# Altium schematic sheet VHDCI1_connector.SchDoc: VHDCI 1
size 420 x 297 mm; Author: G.K.; CompanyName: WUT; DrawnBy: G.K.; Organization: CERN; Address1: Warsaw Univeristy of Technology; Address2: Nowowiejska 15/19; DocumentNumber: 5; Revision: -; SheetNumber: 5; SheetTotal: 10; EDA_Number: ARTIQ; Projet: Banker; ModifiedBy: -; CreateDate: XX/XX/XXXX; CheckedDate: -; Title2: Connector & driver; DivGrp: ISE; Designer: G.K.; ModifiedDate: -; ProjectName: ADC/DAC MEZZANINE
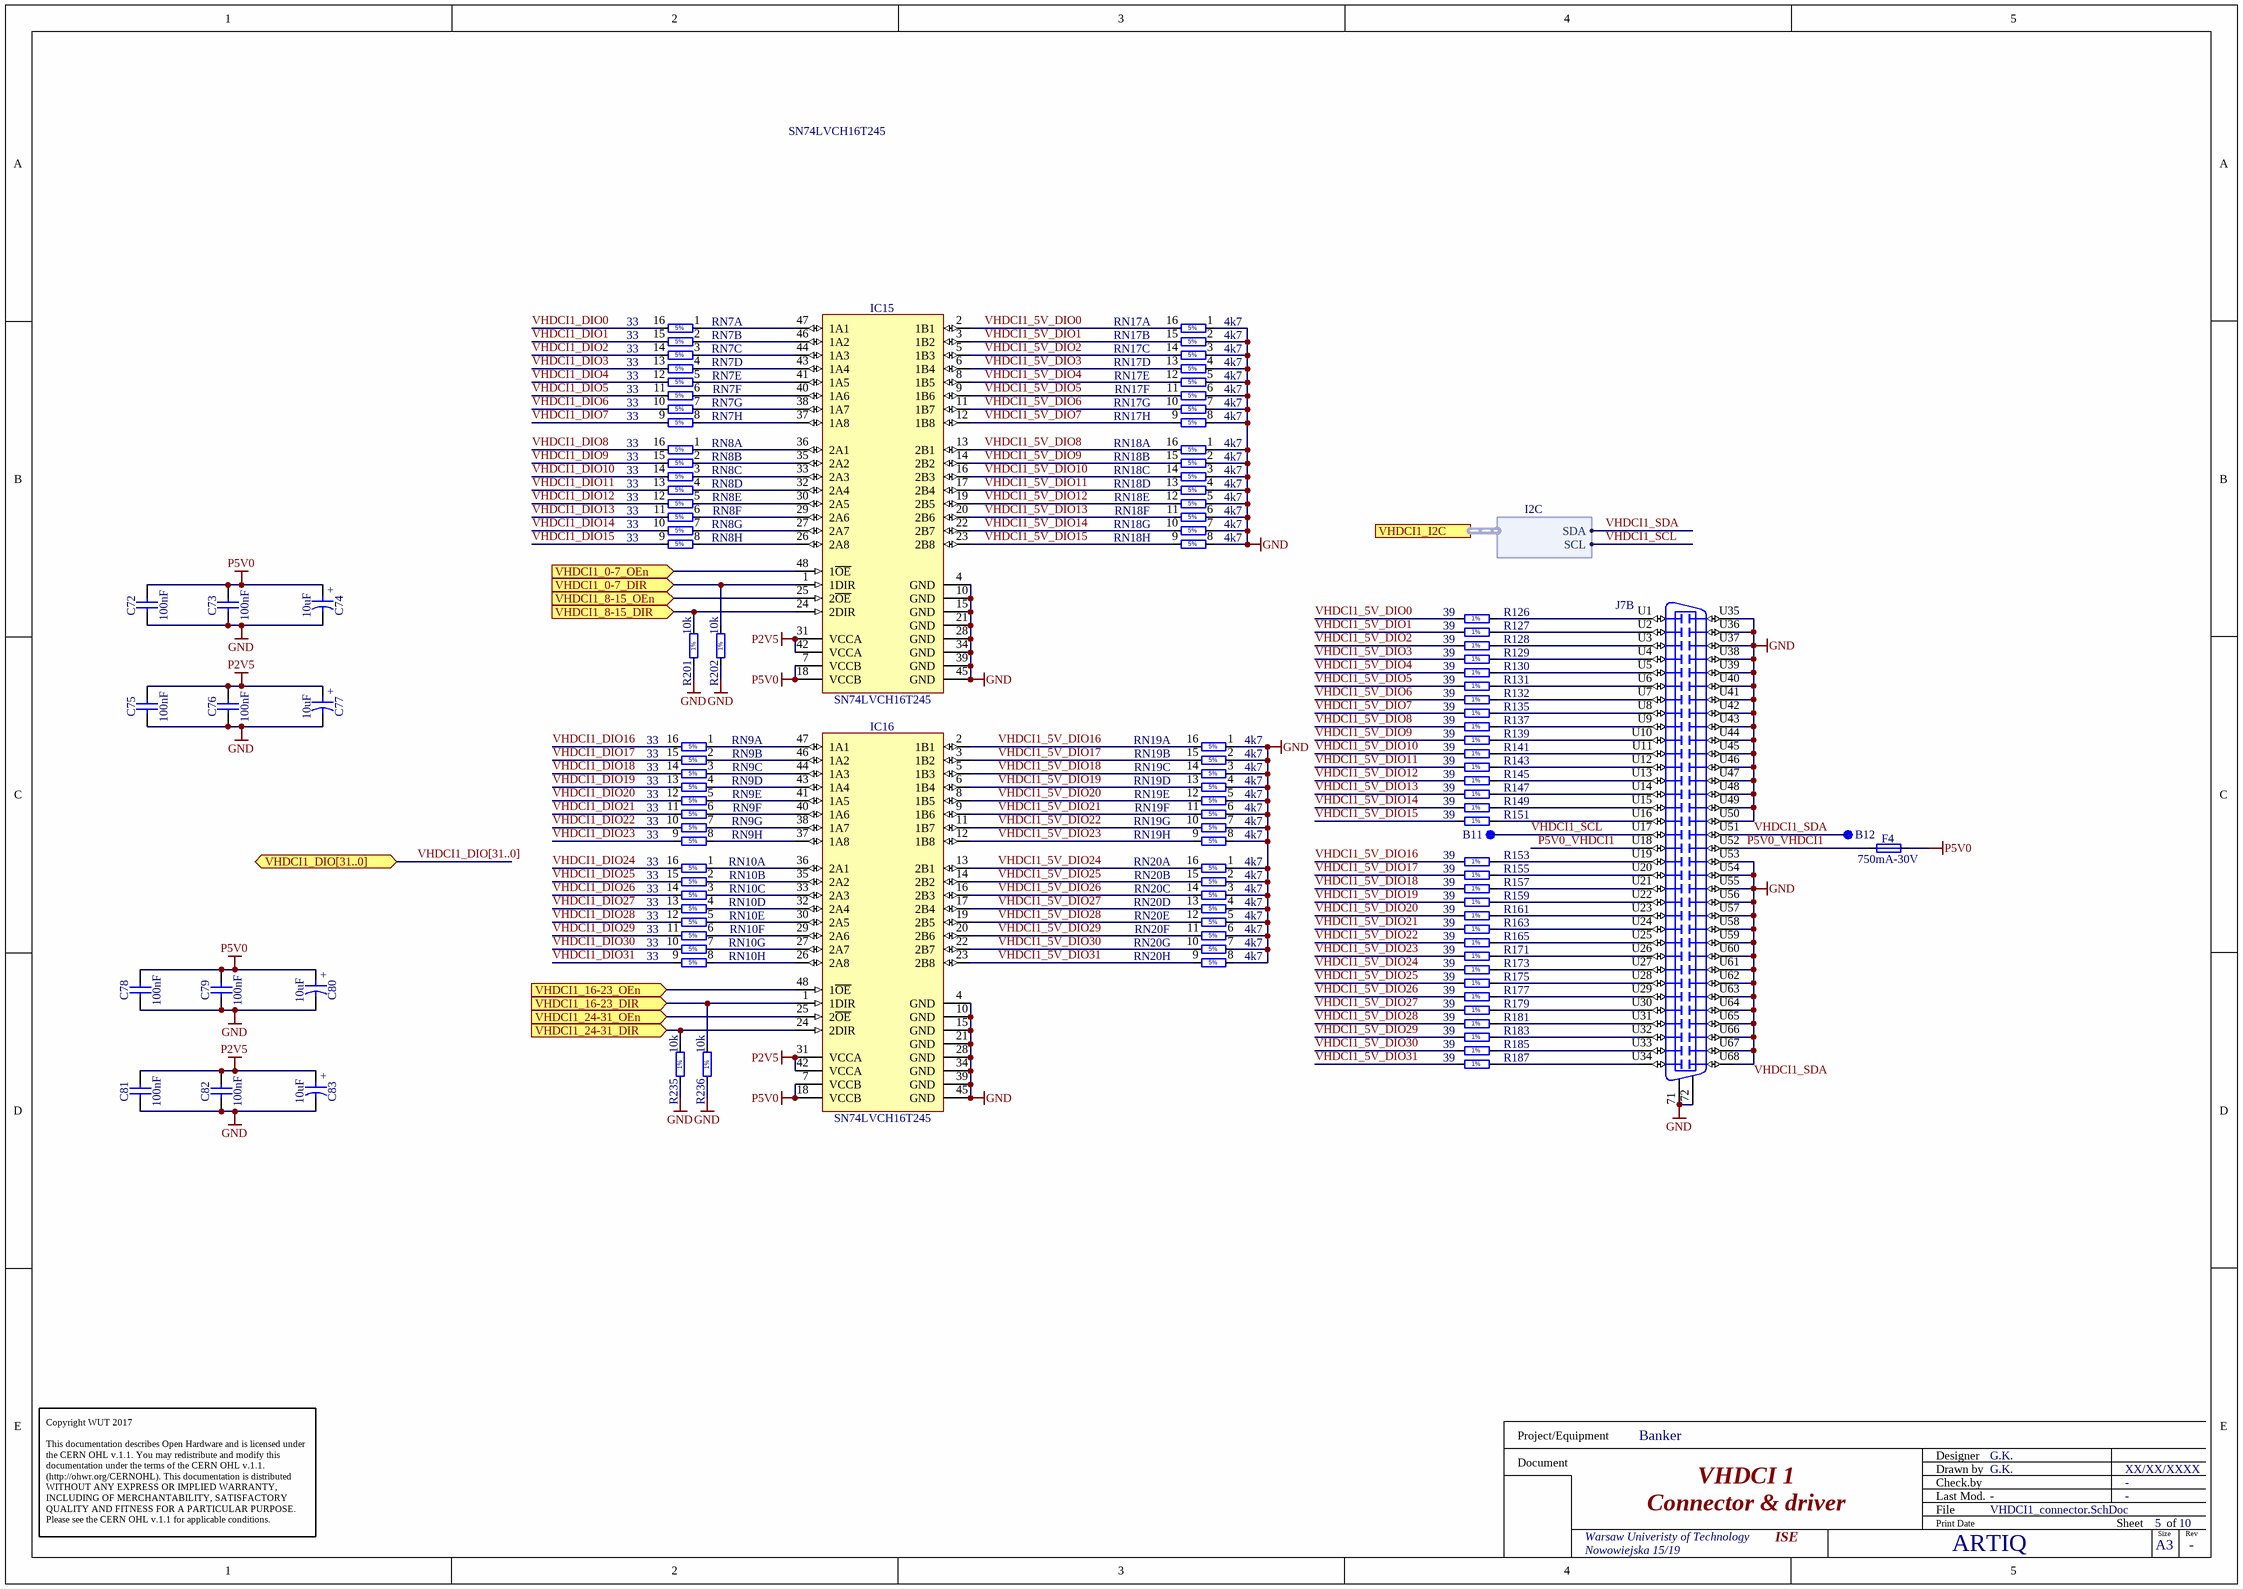
[diagram p0: VHDCI1_connector.SchDoc]

## Parts
B11  SMD Pad  [C100]  (value not drawn)
B12  SMD Pad  [C100]  (value not drawn)
C72  100nF  [CAPC1005X55N]
C73  100nF  [CAPC1005X55N]
C74  10uF  [CAPAE430X540N]
C75  100nF  [CAPC1005X55N]
C76  100nF  [CAPC1005X55N]
C77  10uF  [CAPAE430X540N]
C78  100nF  [CAPC1005X55N]
C79  100nF  [CAPC1005X55N]
C80  10uF  [CAPAE430X540N]
C81  100nF  [CAPC1005X55N]
C82  100nF  [CAPC1005X55N]
C83  10uF  [CAPAE430X540N]
F4  750mA-30V  [FUSR_BOURNS_MF-SM075]
IC15  SN74LVCH16T245  [SOP50P810X120-48N]
IC16  SN74LVCH16T245  [SOP50P810X120-48N]
J7  VHDCI  [MOLEX_74337-0015]  (value not drawn)  (part B of 2)
R126  39  [RESC2012X60N]
R127  39  [RESC2012X60N]
R128  39  [RESC2012X60N]
R129  39  [RESC2012X60N]
R130  39  [RESC2012X60N]
R131  39  [RESC2012X60N]
R132  39  [RESC2012X60N]
R135  39  [RESC2012X60N]
R137  39  [RESC2012X60N]
R139  39  [RESC2012X60N]
R141  39  [RESC2012X60N]
R143  39  [RESC2012X60N]
R145  39  [RESC2012X60N]
R147  39  [RESC2012X60N]
R149  39  [RESC2012X60N]
R151  39  [RESC2012X60N]
R153  39  [RESC2012X60N]
R155  39  [RESC2012X60N]
R157  39  [RESC2012X60N]
R159  39  [RESC2012X60N]
R161  39  [RESC2012X60N]
R163  39  [RESC2012X60N]
R165  39  [RESC2012X60N]
R171  39  [RESC2012X60N]
R173  39  [RESC2012X60N]
R175  39  [RESC2012X60N]
R177  39  [RESC2012X60N]
R179  39  [RESC2012X60N]
R181  39  [RESC2012X60N]
R183  39  [RESC2012X60N]
R185  39  [RESC2012X60N]
R187  39  [RESC2012X60N]
R201  10k  [RESC1005X40N]
R202  10k  [RESC1005X40N]
R235  10k  [RESC1005X40N]
R236  10k  [RESC1005X40N]
RN7  33  [RN_YAGEO_YC248]  (parts A,B,C,D,E,F,G,H of 8)
RN8  33  [RN_YAGEO_YC248]  (parts A,B,C,D,E,F,G,H of 8)
RN9  33  [RN_YAGEO_YC248]  (parts A,B,C,D,E,F,G,H of 8)
RN10  33  [RN_YAGEO_YC248]  (parts A,B,C,D,E,F,G,H of 8)
RN17  4k7  [RN_YAGEO_YC248]  (parts A,B,C,D,E,F,G,H of 8)
RN18  4k7  [RN_YAGEO_YC248]  (parts A,B,C,D,E,F,G,H of 8)
RN19  4k7  [RN_YAGEO_YC248]  (parts A,B,C,D,E,F,G,H of 8)
RN20  4k7  [RN_YAGEO_YC248]  (parts A,B,C,D,E,F,G,H of 8)

## Ports
VHDCI1_0-7_DIR (in), VHDCI1_0-7_OEn (in), VHDCI1_8-15_DIR (in), VHDCI1_8-15_OEn (in), VHDCI1_16-23_DIR (in), VHDCI1_16-23_OEn (in), VHDCI1_24-31_DIR (in), VHDCI1_24-31_OEn (in), VHDCI1_DIO[31..0] (bidir), VHDCI1_I2C (harness I2C)

## Harnesses
I2C: SDA, SCL

## Nets
GND: C72.1 C73.1 C74.2 C75.1 C76.1 C77.2 C78.1 C79.1 C80.2 C81.1 C82.1 C83.2 IC15.4(GND) IC15.10(GND) IC15.15(GND) IC15.21(GND) IC15.28(GND) IC15.34(GND) IC15.39(GND) IC15.45(GND) IC16.4(GND) IC16.10(GND) IC16.15(GND) IC16.21(GND) IC16.28(GND) IC16.34(GND) IC16.39(GND) IC16.45(GND) J7.71 J7.72 J7.U35 J7.U36 J7.U37 J7.U38 J7.U39 J7.U40 J7.U41 J7.U42 J7.U43 J7.U44 J7.U45 J7.U46 J7.U47 J7.U48 J7.U49 J7.U50 J7.U53 J7.U54 J7.U55 J7.U56 J7.U57 J7.U58 J7.U59 J7.U60 J7.U61 J7.U62 J7.U63 J7.U64 J7.U65 J7.U66 J7.U67 J7.U68 R201.1 R202.1 R235.1 R236.1 RN17.1 RN17.2 RN17.3 RN17.4 RN17.5 RN17.6 RN17.7 RN17.8 RN18.1 RN18.2 RN18.3 RN18.4 RN18.5 RN18.6 RN18.7 RN18.8 RN19.1 RN19.2 RN19.3 RN19.4 RN19.5 RN19.6 RN19.7 RN19.8 RN20.1 RN20.2 RN20.3 RN20.4 RN20.5 RN20.6 RN20.7 RN20.8
P2V5: C75.2 C76.2 C77.1 C81.2 C82.2 C83.1 IC15.31(VCCA) IC15.42(VCCA) IC16.31(VCCA) IC16.42(VCCA)
P5V0: C72.2 C73.2 C74.1 C78.2 C79.2 C80.1 F4.2 IC15.7(VCCB) IC15.18(VCCB) IC16.7(VCCB) IC16.18(VCCB)
P5V0_VHDCI1: F4.1 J7.U18 J7.U52
VHDCI1_0-7_DIR: IC15.1(1DIR) R202.2 ; port VHDCI1_0-7_DIR
VHDCI1_0-7_OEn: IC15.48(1~{OE}) ; port VHDCI1_0-7_OEn
VHDCI1_5V_DIO0: IC15.2(1B1) R126.1 RN17.16
VHDCI1_5V_DIO1: IC15.3(1B2) R127.1 RN17.15
VHDCI1_5V_DIO2: IC15.5(1B3) R128.1 RN17.14
VHDCI1_5V_DIO3: IC15.6(1B4) R129.1 RN17.13
VHDCI1_5V_DIO4: IC15.8(1B5) R130.1 RN17.12
VHDCI1_5V_DIO5: IC15.9(1B6) R131.1 RN17.11
VHDCI1_5V_DIO6: IC15.11(1B7) R132.1 RN17.10
VHDCI1_5V_DIO7: IC15.12(1B8) R135.1 RN17.9
VHDCI1_5V_DIO8: IC15.13(2B1) R137.1 RN18.16
VHDCI1_5V_DIO9: IC15.14(2B2) R139.1 RN18.15
VHDCI1_5V_DIO10: IC15.16(2B3) R141.1 RN18.14
VHDCI1_5V_DIO11: IC15.17(2B4) R143.1 RN18.13
VHDCI1_5V_DIO12: IC15.19(2B5) R145.1 RN18.12
VHDCI1_5V_DIO13: IC15.20(2B6) R147.1 RN18.11
VHDCI1_5V_DIO14: IC15.22(2B7) R149.1 RN18.10
VHDCI1_5V_DIO15: IC15.23(2B8) R151.1 RN18.9
VHDCI1_5V_DIO16: IC16.2(1B1) R153.1 RN19.16
VHDCI1_5V_DIO17: IC16.3(1B2) R155.1 RN19.15
VHDCI1_5V_DIO18: IC16.5(1B3) R157.1 RN19.14
VHDCI1_5V_DIO19: IC16.6(1B4) R159.1 RN19.13
VHDCI1_5V_DIO20: IC16.8(1B5) R161.1 RN19.12
VHDCI1_5V_DIO21: IC16.9(1B6) R163.1 RN19.11
VHDCI1_5V_DIO22: IC16.11(1B7) R165.1 RN19.10
VHDCI1_5V_DIO23: IC16.12(1B8) R171.1 RN19.9
VHDCI1_5V_DIO24: IC16.13(2B1) R173.1 RN20.16
VHDCI1_5V_DIO25: IC16.14(2B2) R175.1 RN20.15
VHDCI1_5V_DIO26: IC16.16(2B3) R177.1 RN20.14
VHDCI1_5V_DIO27: IC16.17(2B4) R179.1 RN20.13
VHDCI1_5V_DIO28: IC16.19(2B5) R181.1 RN20.12
VHDCI1_5V_DIO29: IC16.20(2B6) R183.1 RN20.11
VHDCI1_5V_DIO30: IC16.22(2B7) R185.1 RN20.10
VHDCI1_5V_DIO31: IC16.23(2B8) R187.1 RN20.9
VHDCI1_8-15_DIR: IC15.24(2DIR) R201.2 ; port VHDCI1_8-15_DIR
VHDCI1_8-15_OEn: IC15.25(2~{OE}) ; port VHDCI1_8-15_OEn
VHDCI1_16-23_DIR: IC16.1(1DIR) R236.2 ; port VHDCI1_16-23_DIR
VHDCI1_16-23_OEn: IC16.48(1~{OE}) ; port VHDCI1_16-23_OEn
VHDCI1_24-31_DIR: IC16.24(2DIR) R235.2 ; port VHDCI1_24-31_DIR
VHDCI1_24-31_OEn: IC16.25(2~{OE}) ; port VHDCI1_24-31_OEn
VHDCI1_DIO0: RN7.16
VHDCI1_DIO1: RN7.15
VHDCI1_DIO2: RN7.14
VHDCI1_DIO3: RN7.13
VHDCI1_DIO4: RN7.12
VHDCI1_DIO5: RN7.11
VHDCI1_DIO6: RN7.10
VHDCI1_DIO7: RN7.9
VHDCI1_DIO8: RN8.16
VHDCI1_DIO9: RN8.15
VHDCI1_DIO10: RN8.14
VHDCI1_DIO11: RN8.13
VHDCI1_DIO12: RN8.12
VHDCI1_DIO13: RN8.11
VHDCI1_DIO14: RN8.10
VHDCI1_DIO15: RN8.9
VHDCI1_DIO16: RN9.16
VHDCI1_DIO17: RN9.15
VHDCI1_DIO18: RN9.14
VHDCI1_DIO19: RN9.13
VHDCI1_DIO20: RN9.12
VHDCI1_DIO21: RN9.11
VHDCI1_DIO22: RN9.10
VHDCI1_DIO23: RN9.9
VHDCI1_DIO24: RN10.16
VHDCI1_DIO25: RN10.15
VHDCI1_DIO26: RN10.14
VHDCI1_DIO27: RN10.13
VHDCI1_DIO28: RN10.12
VHDCI1_DIO29: RN10.11
VHDCI1_DIO30: RN10.10
VHDCI1_DIO31: RN10.9
VHDCI1_SCL: B11.1 J7.U17 ; port VHDCI1_I2C.SCL
VHDCI1_SDA: B12.1 J7.U51 ; port VHDCI1_I2C.SDA
NetIC15_26: IC15.26(2A8) RN8.8
NetIC15_27: IC15.27(2A7) RN8.7
NetIC15_29: IC15.29(2A6) RN8.6
NetIC15_30: IC15.30(2A5) RN8.5
NetIC15_32: IC15.32(2A4) RN8.4
NetIC15_33: IC15.33(2A3) RN8.3
NetIC15_35: IC15.35(2A2) RN8.2
NetIC15_36: IC15.36(2A1) RN8.1
NetIC15_37: IC15.37(1A8) RN7.8
NetIC15_38: IC15.38(1A7) RN7.7
NetIC15_40: IC15.40(1A6) RN7.6
NetIC15_41: IC15.41(1A5) RN7.5
NetIC15_43: IC15.43(1A4) RN7.4
NetIC15_44: IC15.44(1A3) RN7.3
NetIC15_46: IC15.46(1A2) RN7.2
NetIC15_47: IC15.47(1A1) RN7.1
NetIC16_26: IC16.26(2A8) RN10.8
NetIC16_27: IC16.27(2A7) RN10.7
NetIC16_29: IC16.29(2A6) RN10.6
NetIC16_30: IC16.30(2A5) RN10.5
NetIC16_32: IC16.32(2A4) RN10.4
NetIC16_33: IC16.33(2A3) RN10.3
NetIC16_35: IC16.35(2A2) RN10.2
NetIC16_36: IC16.36(2A1) RN10.1
NetIC16_37: IC16.37(1A8) RN9.8
NetIC16_38: IC16.38(1A7) RN9.7
NetIC16_40: IC16.40(1A6) RN9.6
NetIC16_41: IC16.41(1A5) RN9.5
NetIC16_43: IC16.43(1A4) RN9.4
NetIC16_44: IC16.44(1A3) RN9.3
NetIC16_46: IC16.46(1A2) RN9.2
NetIC16_47: IC16.47(1A1) RN9.1
NetJ7_U1: J7.U1 R126.2
NetJ7_U2: J7.U2 R127.2
NetJ7_U3: J7.U3 R128.2
NetJ7_U4: J7.U4 R129.2
NetJ7_U5: J7.U5 R130.2
NetJ7_U6: J7.U6 R131.2
NetJ7_U7: J7.U7 R132.2
NetJ7_U8: J7.U8 R135.2
NetJ7_U9: J7.U9 R137.2
NetJ7_U10: J7.U10 R139.2
NetJ7_U11: J7.U11 R141.2
NetJ7_U12: J7.U12 R143.2
NetJ7_U13: J7.U13 R145.2
NetJ7_U14: J7.U14 R147.2
NetJ7_U15: J7.U15 R149.2
NetJ7_U16: J7.U16 R151.2
NetJ7_U19: J7.U19 R153.2
NetJ7_U20: J7.U20 R155.2
NetJ7_U21: J7.U21 R157.2
NetJ7_U22: J7.U22 R159.2
NetJ7_U23: J7.U23 R161.2
NetJ7_U24: J7.U24 R163.2
NetJ7_U25: J7.U25 R165.2
NetJ7_U26: J7.U26 R171.2
NetJ7_U27: J7.U27 R173.2
NetJ7_U28: J7.U28 R175.2
NetJ7_U29: J7.U29 R177.2
NetJ7_U30: J7.U30 R179.2
NetJ7_U31: J7.U31 R181.2
NetJ7_U32: J7.U32 R183.2
NetJ7_U33: J7.U33 R185.2
NetJ7_U34: J7.U34 R187.2

## Buses and harness runs
bus VHDCI1_DIO[31..0] = port VHDCI1_DIO[31..0]

## Notes on the sheet
- SN74LVCH16T245
- Copyright WUT 2017
  This documentation describes Open Hardware and is licensed under the CERN OHL v.1.1. You may redistribute and modify this documentation under the terms of the CERN OHL v.1.1. (http://ohwr.org/CERNOHL). This documentation is distributed WITHOUT ANY EXPRESS OR IMPLIED WARRANTY, INCLUDING OF MERCHANTABILITY, SATISFACTORY QUALITY AND FITNESS FOR A PARTICULAR PURPOSE. Please see the CERN OHL v.1.1 for applicable conditions.
- Labels drawn without touching a wire or pin: VHDCI1_SDA
- Project/Equipment
- Document
- Designer
- Drawn by
- Check.by
- File
- Last Mod.
- Print Date
- Sheet
- Size
- A3
- of
- Rev
- (in symbol CAE430-540_10UF_16V_20%) +
- (in symbol R0402_10K_1%_0.0625W_100PPM) 1%
- (in symbol R0805_39R_1%_0.125W_100PPM) 1%
- (in symbol RES_RN_4K7_YAGEO_YC248-JR-074K7L, part A) 5%
- (in symbol RES_RN_4K7_YAGEO_YC248-JR-074K7L, part B) 5%
- (in symbol RES_RN_4K7_YAGEO_YC248-JR-074K7L, part C) 5%
- (in symbol RES_RN_4K7_YAGEO_YC248-JR-074K7L, part D) 5%
- (in symbol RES_RN_4K7_YAGEO_YC248-JR-074K7L, part E) 5%
- (in symbol RES_RN_4K7_YAGEO_YC248-JR-074K7L, part F) 5%
- (in symbol RES_RN_4K7_YAGEO_YC248-JR-074K7L, part G) 5%
- (in symbol RES_RN_4K7_YAGEO_YC248-JR-074K7L, part H) 5%
- (in symbol RN_33R_YAGEO_YC248-JR-0733RL, part A) 5%
- (in symbol RN_33R_YAGEO_YC248-JR-0733RL, part B) 5%
- (in symbol RN_33R_YAGEO_YC248-JR-0733RL, part C) 5%
- (in symbol RN_33R_YAGEO_YC248-JR-0733RL, part D) 5%
- (in symbol RN_33R_YAGEO_YC248-JR-0733RL, part E) 5%
- (in symbol RN_33R_YAGEO_YC248-JR-0733RL, part F) 5%
- (in symbol RN_33R_YAGEO_YC248-JR-0733RL, part G) 5%
- (in symbol RN_33R_YAGEO_YC248-JR-0733RL, part H) 5%

## Library data of the parts
B11 B12 = SMD_PAD_D1MM: Through Hole Pad; Part Description: 1mm Diameter SMD Pad; Mounted: No; Part Number: SMD_PAD_D1MM; Component Kind: Standard (No BOM); Component Type: Standard (No BOM); Pin Count: 1; Family: SMD Pad; Socket: No; SMD: No; Sense: No; Status: None; ComponentHeight: 0mm; HelpURL: Undefined; Author: CERN DEM JLC; CreateDate: 10.10.2017; LatestRevisionDate: 10.10.2017; PackageDescription: 1mm Diameter SMD Pad
C72 C73 C75 C76 C78 C79 C81 C82 = CC0402_100NF_16V_10%_X5R: Non-polarised capacitor; Part Description: SMD Multilayer Chip Ceramic Capacitor; Manufacturer: GENERIC; Manufacturer1 Part Number: GRM155R61C104KA88D; Voltage: 16V; TC: X5R; Tolerance: ±10%; Part Number: CC0402_100NF_16V_10%_X5R; Component Kind: Standard; Component Type: Standard; Pin Count: 2; Value: 100nF; Status: None; Manufacturer Part Number: CC0402_100NF_16V_10%_X5R; Case: 0402; Mounted: Yes; Socket: No; SMD: Yes; Sense: No; Manufacturer1 Example: MURATA; Manufacturer1 ComponentHeight: 0.55mm; HelpURL: \\cern.ch\dfs\Applications\Altium\Datasheets\CC0402_X5R_MURATA_GRM.pdf; Author: CERN DEM JLC; CreateDate: 10.12.2013; LatestRevisionDate: 10.12.2013
C74 C77 C80 C83 = CAE430-540_10UF_16V_20%: Polarised capacitor; Part Description: Aluminum Electrolytic SMT Capacitor; Manufacturer: PANASONIC; Manufacturer Part Number: EEEFK1C100AR; Voltage: 16V; Tolerance: ±20%; Part Number: CAE430-540_10UF_16V_20%; Component Kind: Standard; Component Type: Standard; Pin Count: 2; Value: 10uF; Status: Not Recommended; Case: B; Mounted: Yes; Socket: No; SMD: Yes; Sense: No; ComponentHeight: 5.8mm; HelpURL: \\cern.ch\dfs\Applications\Altium\Datasheets\CAE_PANASONIC_FK.pdf; Author: CERN DEM JLC; CreateDate: 03.12.2007; LatestRevisionDate: 05.11.2014
F4 = FUSR_BOURNS_MF-SM075-2: Fuse; Part Description: PTC Resettable Fuse; Manufacturer: BOURNS; PressFit: No; Part Number: FUSR_BOURNS_MF-SM075-2; Component Kind: Standard; Component Type: Standard; Pin Count: 2; PackageDescription: PolySwitch, 2-Leads, Body 7.35x5.12mm Nominal; Family: Fuses Resettable; Mounted: Yes; Socket: No; SMD: Yes; Sense: No; Value: 750mA-30V; Manufacturer Part Number: MF-SM075-2; ComponentHeight: 3.18mm; HelpURL: \\cern.ch\dfs\Applications\Altium\Datasheets\FUSR_BOURNS_MF-SM075-2.pdf; Author: CERN DEM JLC; CreateDate: 01/03/2012; LatestRevisionDate: 07/11/2012
IC15 IC16 = 74LVCH16T245: 16-Bit Dual-Supply Bus Transceiver With Configurable Voltage Translation And 3-State Outputs; Part Number: SN74LVCH16T245DGGR; Part Description: 16-Bit Dual-Supply Bus Transceivers With Configurable Voltage Translation And 3-State Outputs; Manufacturer: TEXAS INSTRUMENTS; PressFit: No; Bonding: No; Component Kind: Standard; Component Type: Standard; Device: SN74LVCH16T245; PackageDescription: SOP, 48-Leads, Body 12.6x6.2mm (max), Pitch 0.50mm, IPC Medium Density; Manufacturer Part Number: SN74LVCH16T245DGGR; Pin Count: 48; Case: TSSOP48; Mounted: Yes; Socket: No; SMD: Yes; Sense: No; ComponentHeight: 1.2mm; Author: GK; HelpURL: \\cern.ch\dfs\Applications\Altium\Datasheets\CLVCH16T245MDGGREP.pdf; CreateDate: 09/02/2016; LatestRevisionDate: 09/02/2016
J7 = MOLEX_74337-0015: Very High Density Cable Interconnect (VHDCI ) 2x68 Female; Part Number: Delivered by GK; Part Description: 2x68 Positions, Pitch 0.8mm, Very Hight Density Right Angle Dual Stacked VHDCI Receptacle; Manufacturer: MOLEX; PressFit: No; Component Kind: Standard; Component Type: Standard; Pin Count: 140; Family: VHDCI; Mounted: Yes; Socket: No; SMD: No; Sense: No; Status: None; Manufacturer Part Number: Delivered by GK; ComponentHeight: 10.78mm; HelpURL: \\cern.ch\dfs\Applications\Altium\Datasheets\MOLEX_74337-0015.pdf; Author: CERN DEM JLC; CreateDate: 30.04.2014; LatestRevisionDate: 30.04.2014
R126-R132 R135 R137 R139 R141 R143 R145 R147 R149 R151 R153 R155 R157 R159 R161 R163 R165 R171 R173 R175 R177 R179 R181 R183 R185 R187 = R0805_39R_1%_0.125W_100PPM: Resistor - 1%; Part Description: General Purpose Thick Film Chip Resistor; Manufacturer: GENERIC; Manufacturer1 Part Number: NRC10F39R0TRF; Power: 0.125W; TC: ±100ppm/°C; PressFit: No; Part Number: R0805_39R_1%_0.125W_100PPM; Component Kind: Standard; Component Type: Standard; Pin Count: 2; Value: 39; Status: Preferred; Tolerance: ±1%; Manufacturer Part Number: R0805_39R_1%_0.125W_100PPM; Case: 0805; Mounted: Yes; Sense: No; Socket: No; SMD: Yes; Manufacturer1 Example: NIC COMPONENT; Manufacturer1 ComponentHeight: 0.6mm; HelpURL: \\cern.ch\dfs\Applications\Altium\Datasheets\R0805_NIC_NRC.pdf; Author: CERN DEM JLC; CreateDate: 03/12/2007; LatestRevisionDate: 13/03/2008
R201 R202 R235 R236 = R0402_10K_1%_0.0625W_100PPM: Resistor - 1%; Part Description: General Purpose Thick Film Chip Resistor; Manufacturer: GENERIC; Manufacturer1 Part Number: 232270671003L; TC: ±100ppm/°C; PressFit: No; Part Number: R0402_10K_1%_0.0625W_100PPM; Component Kind: Standard; Component Type: Standard; Pin Count: 2; Value: 10k; Status: Not Recommended; Power: 0.0625W; Tolerance: ±1%; Manufacturer Part Number: R0402_10K_1%_0.0625W_100PPM; Case: 0402; Mounted: Yes; Sense: No; Socket: No; SMD: Yes; Manufacturer1 Example: YAGEO PHYCOMP; Manufacturer1 ComponentHeight: 0.4mm; HelpURL: \\cern.ch\dfs\Applications\Altium\Datasheets\R0402_Phycomp_RC0402.pdf; Author: CERN DEM JLC; CreateDate: 03/12/2007; LatestRevisionDate: 17/10/2012
RN7-RN10 = RN_33R_YAGEO_YC248-JR-0733RL: DIL16 Resistor Network 8 Isolated Resistor 5%; Part Description: Chip Resistor Array , 8 Isolated Resistors (Side Convex Terminal), YC248 Series; Manufacturer: YAGEO; Power: 0.062W; PressFit: No; TC: ±200ppm/°C; Part Number: RN_33R_YAGEO_YC248-JR-0733RL; Component Kind: Standard; Component Type: Standard; Pin Count: 16; Value: 33; Sense: No; Tolerance: ±5%; Manufacturer Part Number: YC248-JR-0733RL; Mounted: Yes; Socket: No; SMD: Yes; ComponentHeight: 0.55mm; HelpURL: \\cern.ch\dfs\Applications\Altium\Datasheets\RN_YAGEO_YC248.pdf; Author: CERN DEM JLC; CreateDate: 13/01/2011; LatestRevisionDate: 13/01/2011
RN17-RN20 = RES_RN_4K7_YAGEO_YC248-JR-074K7L: 8x Resistor Network  Isolated Resistor 5%; Part Number: RN_33R_YAGEO_YC248-JR-074K7L; Part Description: Chip Resistor Array , 8 Isolated Resistors (Side Convex Terminal), YC248 Series; Manufacturer: YAGEO; Power: 0.062W; PressFit: No; TC: ±200ppm/°C; Component Kind: Standard; Component Type: Standard; Pin Count: 16; Value: 4k7; Sense: No; Tolerance: ±5%; Manufacturer Part Number: YC248-JR-074K7L; Mounted: Yes; Socket: No; SMD: Yes; ComponentHeight: 0.55mm; HelpURL: \\cern.ch\dfs\Applications\Altium\Datasheets\RN_YAGEO_YC248.pdf; Author: GK; CreateDate: 13/01/2011; LatestRevisionDate: 13/01/2011